# EAGLE design Plant Reminder (EAGLE 9.5.2)
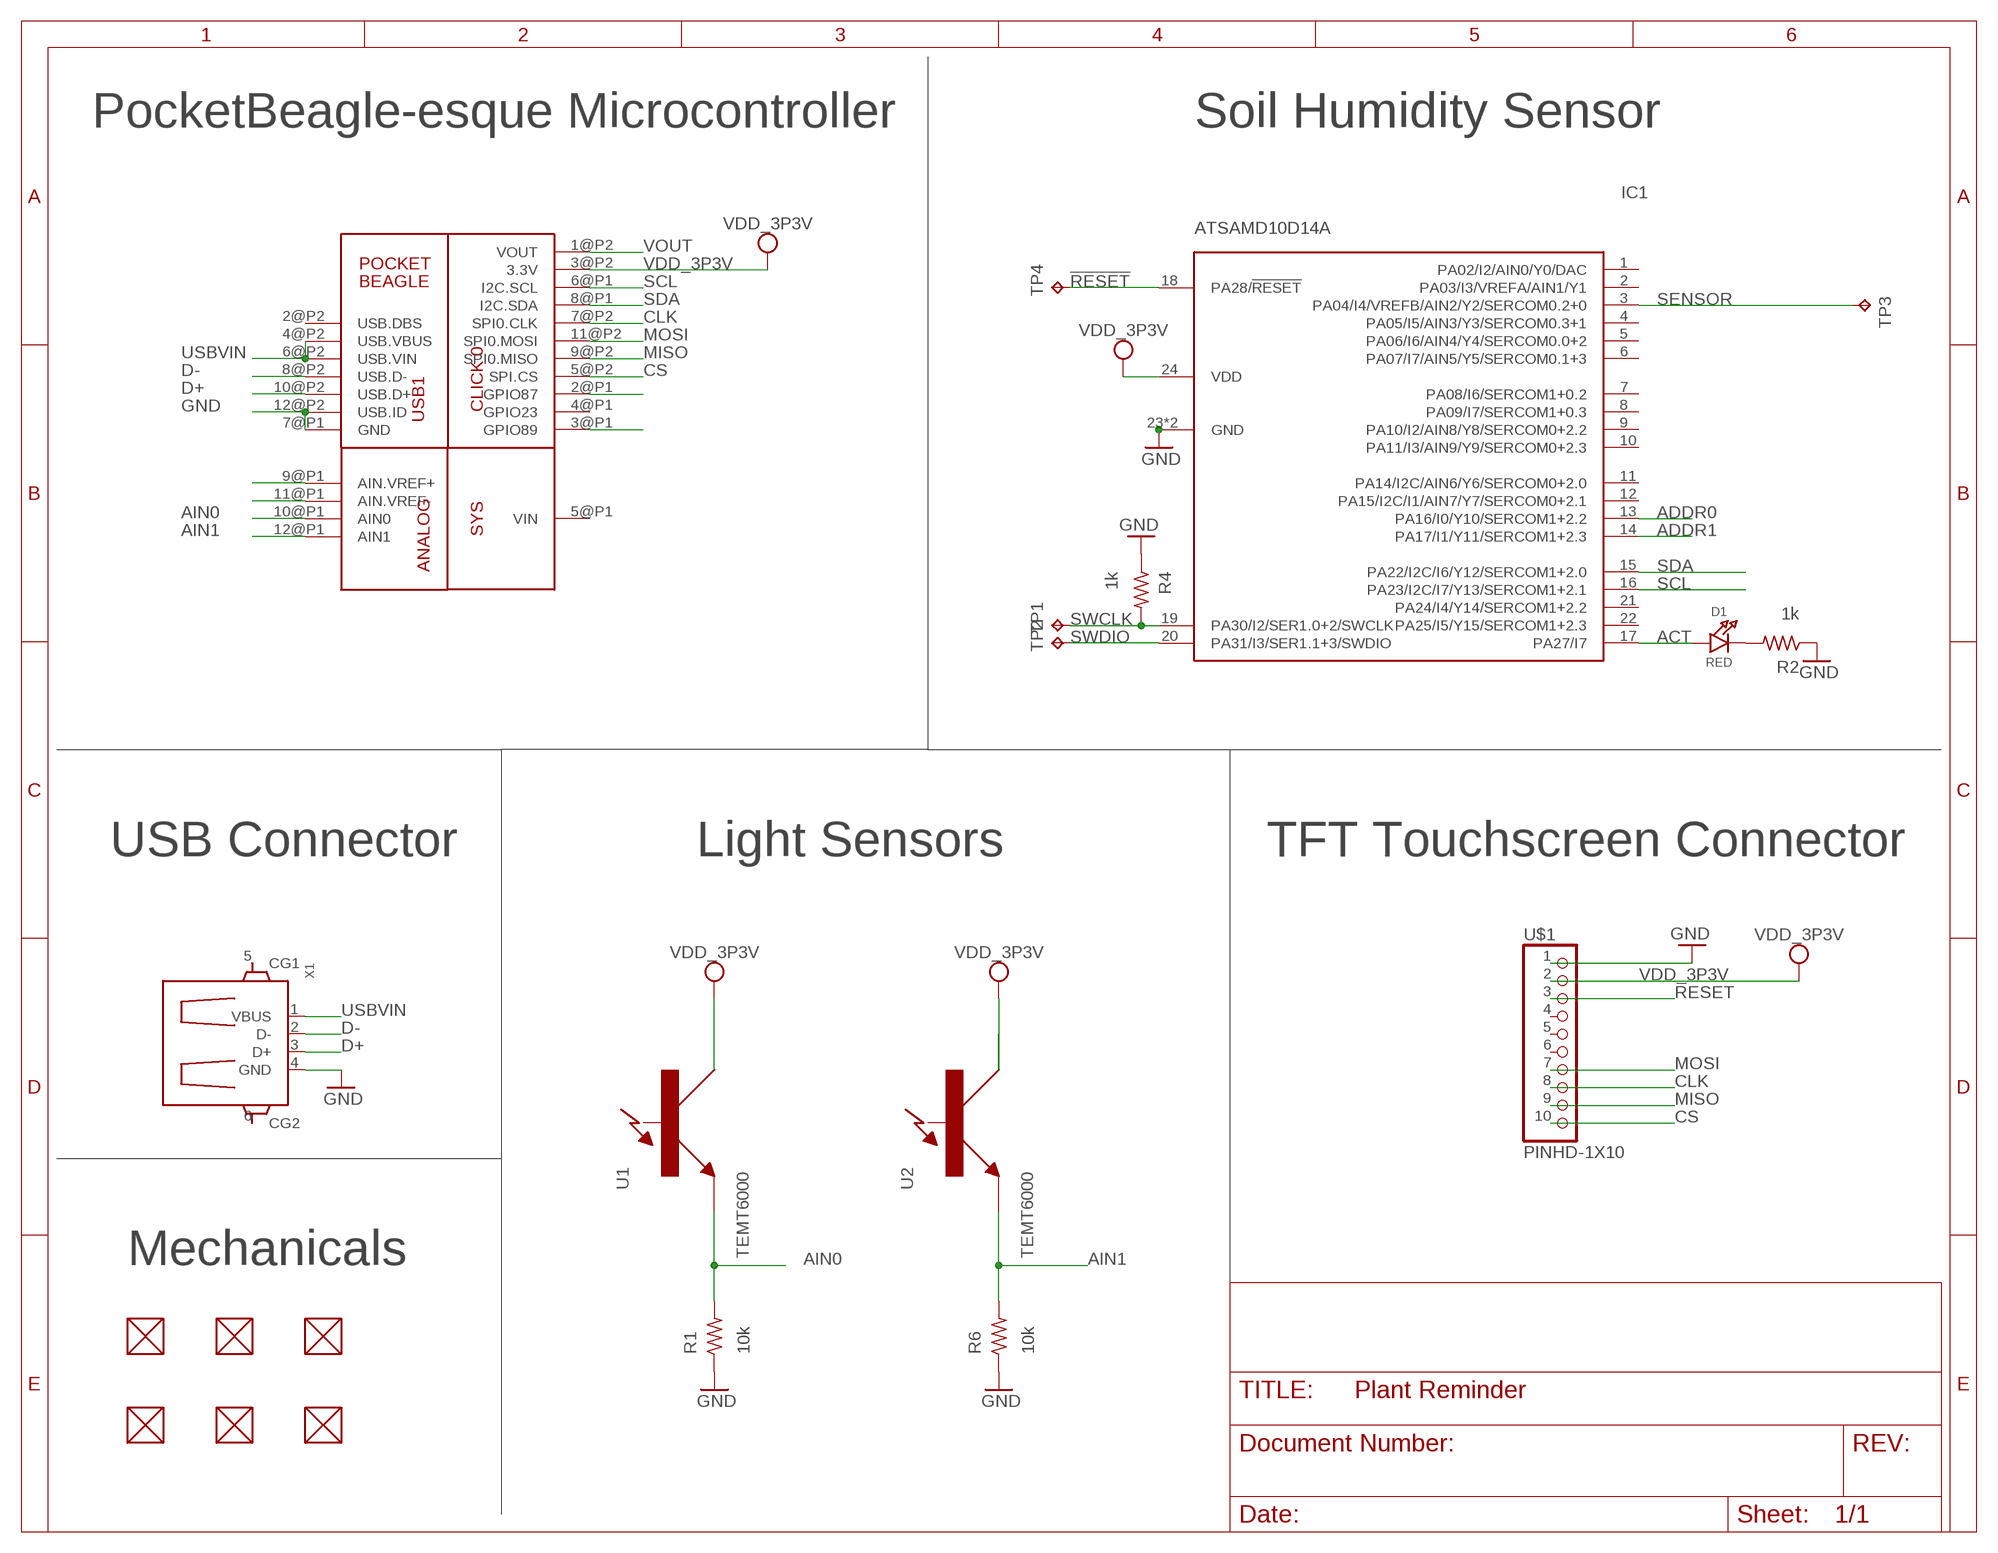
[diagram p0: schematic, sheet 1]

## Parts
D1  RED  LED0805_NOOUTLINE  [CHIPLED_0805_NOOUTLINE]
FUD1  FIDUCIAL  [FIDUCIAL_40MIL]
FUD2  FIDUCIAL  [FIDUCIAL_40MIL]
FUD3  FIDUCIAL  [FIDUCIAL_40MIL]
FUD4  FIDUCIAL  [FIDUCIAL_40MIL]
FUD5  FIDUCIAL  [FIDUCIAL_40MIL]
FUD6  FIDUCIAL  [FIDUCIAL_40MIL]
IC1  ATSAMD10D14A  [QFN24_4MM]
R1  10k  R_R0402  [R0402]
R2  1k  R_R0402  [R0402]
R4  1k  R_R0402  [R0402]
R6  10k  R_R0402  [R0402]
TP1  TPTP15R  [TP15R]
TP2  TPTP15R  [TP15R]
TP3  TPTP10R  [TP10R]
TP4  TPTP15R  [TP15R]
U1  TEMT6000  [TEMT6000]
U2  TEMT6000  [TEMT6000]
U3  POCKETBEAGLE  [POCKETBEAGLE]
U$1  PINHD-1X10  [1X10-BIG]
X1  GHI2_USB_HOST_W/CHASSIS_GND  [GHI2_USB_HOST_HORIZONTAL_W/CHASSIS_GND]

## Nets
!RESET: IC1.18(PA28/!RESET) TP4.TP
ACT: D1.A IC1.17(PA27/I7)
ADDR0: IC1.13(PA16/I0/Y10/SERCOM1+2.2)
ADDR1: IC1.14(PA17/I1/Y11/SERCOM1+2.3)
AIN0: R1.2 U1.P$2 U3.10@P1(AIN0)
AIN1: R6.2 U2.P$2 U3.12@P1(AIN1)
CLK: U3.7@P2(SPI0.CLK) U$1.8
CS: U3.5@P2(SPI.CS) U$1.10
D+: U3.10@P2(USB.D+) X1.3(D+)
D-: U3.8@P2(USB.D-) X1.2(D-)
GND: IC1.23(GND) IC1.THERM(GND) R1.1 R2.1 R4.1 R6.1 U3.7@P1(GND) U3.12@P2(USB.ID) U$1.1 X1.4(GND)
MISO: U3.9@P2(SPI0.MISO) U$1.9
MOSI: U3.11@P2(SPI0.MOSI) U$1.7
N$2: D1.C R2.2
N$3: U3.9@P1(AIN.VREF+)
N$4: U3.3@P1(GPIO89)
N$6: U3.11@P1(AIN.VREF-)
RESET: U3.2@P1(GPIO87) U$1.3
SCL: IC1.16(PA23/I2C/I7/Y13/SERCOM1+2.1) U3.6@P1(I2C.SCL)
SDA: IC1.15(PA22/I2C/I6/Y12/SERCOM1+2.0) U3.8@P1(I2C.SDA)
SENSOR: IC1.3(PA04/I4/VREFB/AIN2/Y2/SERCOM0.2+0) TP3.TP
SWCLK: IC1.19(PA30/I2/SER1.0+2/SWCLK) R4.2 TP1.TP
SWDIO: IC1.20(PA31/I3/SER1.1+3/SWDIO) TP2.TP
USBVIN: U3.4@P2(USB.VBUS) U3.6@P2(USB.VIN) X1.1(VBUS)
VDD_3P3V: IC1.24(VDD) U1.P$1 U2.P$1 U3.3@P2(3.3V) U$1.2
VOUT: U3.1@P2(VOUT)
Unconnected: FUD1.P$1 FUD2.P$1 FUD3.P$1 FUD4.P$1 FUD5.P$1 FUD6.P$1 IC1.1(PA02/I2/AIN0/Y0/DAC) IC1.2(PA03/I3/VREFA/AIN1/Y1) IC1.4(PA05/I5/AIN3/Y3/SERCOM0.3+1) IC1.5(PA06/I6/AIN4/Y4/SERCOM0.0+2) IC1.6(PA07/I7/AIN5/Y5/SERCOM0.1+3) IC1.7(PA08/I6/SERCOM1+0.2) IC1.8(PA09/I7/SERCOM1+0.3) IC1.9(PA10/I2/AIN8/Y8/SERCOM0+2.2) IC1.10(PA11/I3/AIN9/Y9/SERCOM0+2.3) IC1.11(PA14/I2C/AIN6/Y6/SERCOM0+2.0) IC1.12(PA15/I2C/I1/AIN7/Y7/SERCOM0+2.1) IC1.21(PA24/I4/Y14/SERCOM1+2.2) IC1.22(PA25/I5/Y15/SERCOM1+2.3) U1.P$3 U2.P$3 U3.2@P2(USB.DBS) U3.4@P1(GPIO23) U3.5@P1(VIN) U$1.4 U$1.5 U$1.6 X1.5(CG1) X1.6(CG2)

## Notes on the sheet
- PocketBeagle-esque Microcontroller | Soil Humidity Sensor
- TFT Touchscreen Connector
- USB Connector | Light Sensors
- Mechanicals

## Library data of the parts
D1 = microbuilder:LED: LED 0603 - 0603 Surface Mount Package 2mA: Green LED - Low Power (3.9mcd, 2ma, 1.7Vf) - Digikey: 475-2709-2-ND Orange LED - Low Power (9.8mcd, 2ma, 1.8Vf) - Digikey: 475-1194-2-ND Red LED - Low Power (5mcd, 2ma, 1.8Vf) - Digikey: 475-1195-2-ND Yellow LED - Low Power (7mcd, 2ma, 1.8Vf) - Digikey: 475-1196-2-ND 5mA: Blue LED - Low Power (17mcd, 5ma, 2.9Vf) - Digikey: LNJ937W8CRACT-ND 0805 - 0805 Surface Mount Package 2mA: Red LED (8.8mcd, 2mA, 1.8Vf, Clear) - Low Power [Digikey: 475-2510-1-ND] Green LED (5mcd, 2mA, 1.8Vf, Clear) - Low Power [Digikey: 475-2730-1-ND] Yellow LED (11.3mcd, 2mA, 1.8Vf, Clear) - Low Power [Digikey: 475-2555-1-ND] 20mA: Red LED (104mcd, 20mA, Diffused) - LS R976 [Digikey: 475-1278-6-ND] Red LED (12mcd, 20mA, 2.0Vf, Clear) - APT2012EC [Digikey: 754-1128-1-ND] Green LED (15mcd, 20mA, 2.2Vf, Clear) - APT2012GC [Digikey: 754-1131-1-ND] Orange LED (160mcd, 20mA, 2.1Vf, Clear) - APT2012SECK [Digikey: 754-1130-1-ND] 1206 - 1206 Surface Mount Package Green LED (26mcd, 20mA, Diffused) - LG N971 [Digikey: 475-1407-6-ND] Red LED (15mcd, 20mA, Diffused) - LH N974 [Digikey: 475-1416-6-ND] Cree - Cree High-Power Surface Mount LEDs XPEBWT-L1-0000-00D50 - White 111lm 350mA 2.9Vf 6200K 110° XTEAWT-00-0000-00000LEE3 - White 114lm 350mA 2.85Vf 5000K 115° Everlight - Everlight 45-21 Series Surface Mount LEDs 45-21/QK2C-B2832AC2CB2/2T - Warm White 2000mcd 20mA 3.25Vf 3050K 120° 45-21/LK2C-B38452C4CB2/2T - Nuetral White 2000mcd 20mA 3.25Vf 4150K 120° 45-21/LK2C-B50634C6CB2/2T - Cold White 2200mcd 20mA 3.25Vf 5650K 120° PLCC2 Reverse Mount LS T77K-J1L2-1-0-2-R18-Z - Red 11.25mcd 2mA 1.8Vf 630nm 120° LO T77K-L1M2-24-Z - Orange 19.6mcd 2mA 1.8Vf 606nm 120° LY T77K-K2M1-26-Z - Yellow 15.7mcd 2mA 1.8Vf 587nm 120°
FUD1-FUD6 = ENGI301:FIDUCIAL
IC1 = microbuilder:ATSAMD10D14A
R1 R2 R4 R6 = ENGI301:R_: RESISTOR, American symbol
TP1-TP4 = testpad:TP: Test pad
U1 U2 = Plant Reminder:TEMT6000
U3 = Plant Reminder:POCKETBEAGLE
U$1 = Plant Reminder:PINHD-1X10: Pin header 1x10 0.1" spacing With round pins
X1 = Plant Reminder:GHI2_USB_HOST_W/CHASSIS_GND

## Board
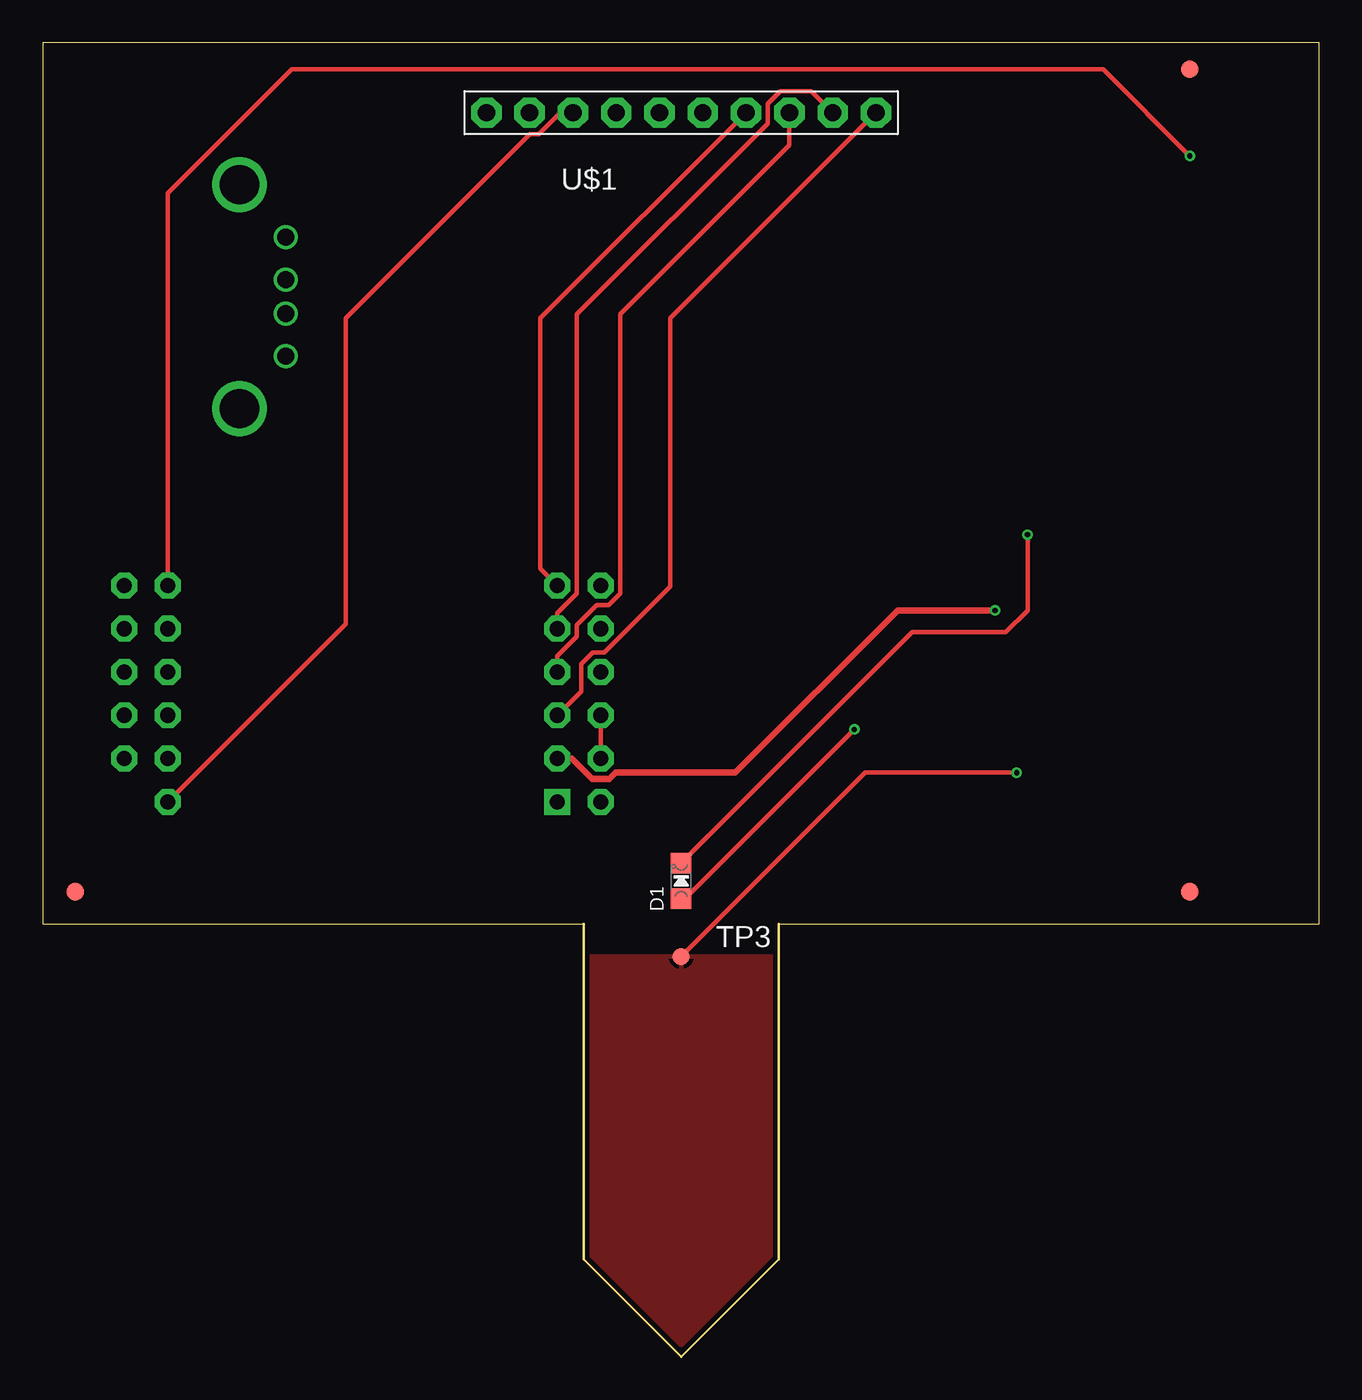
[diagram p1: board, top side]
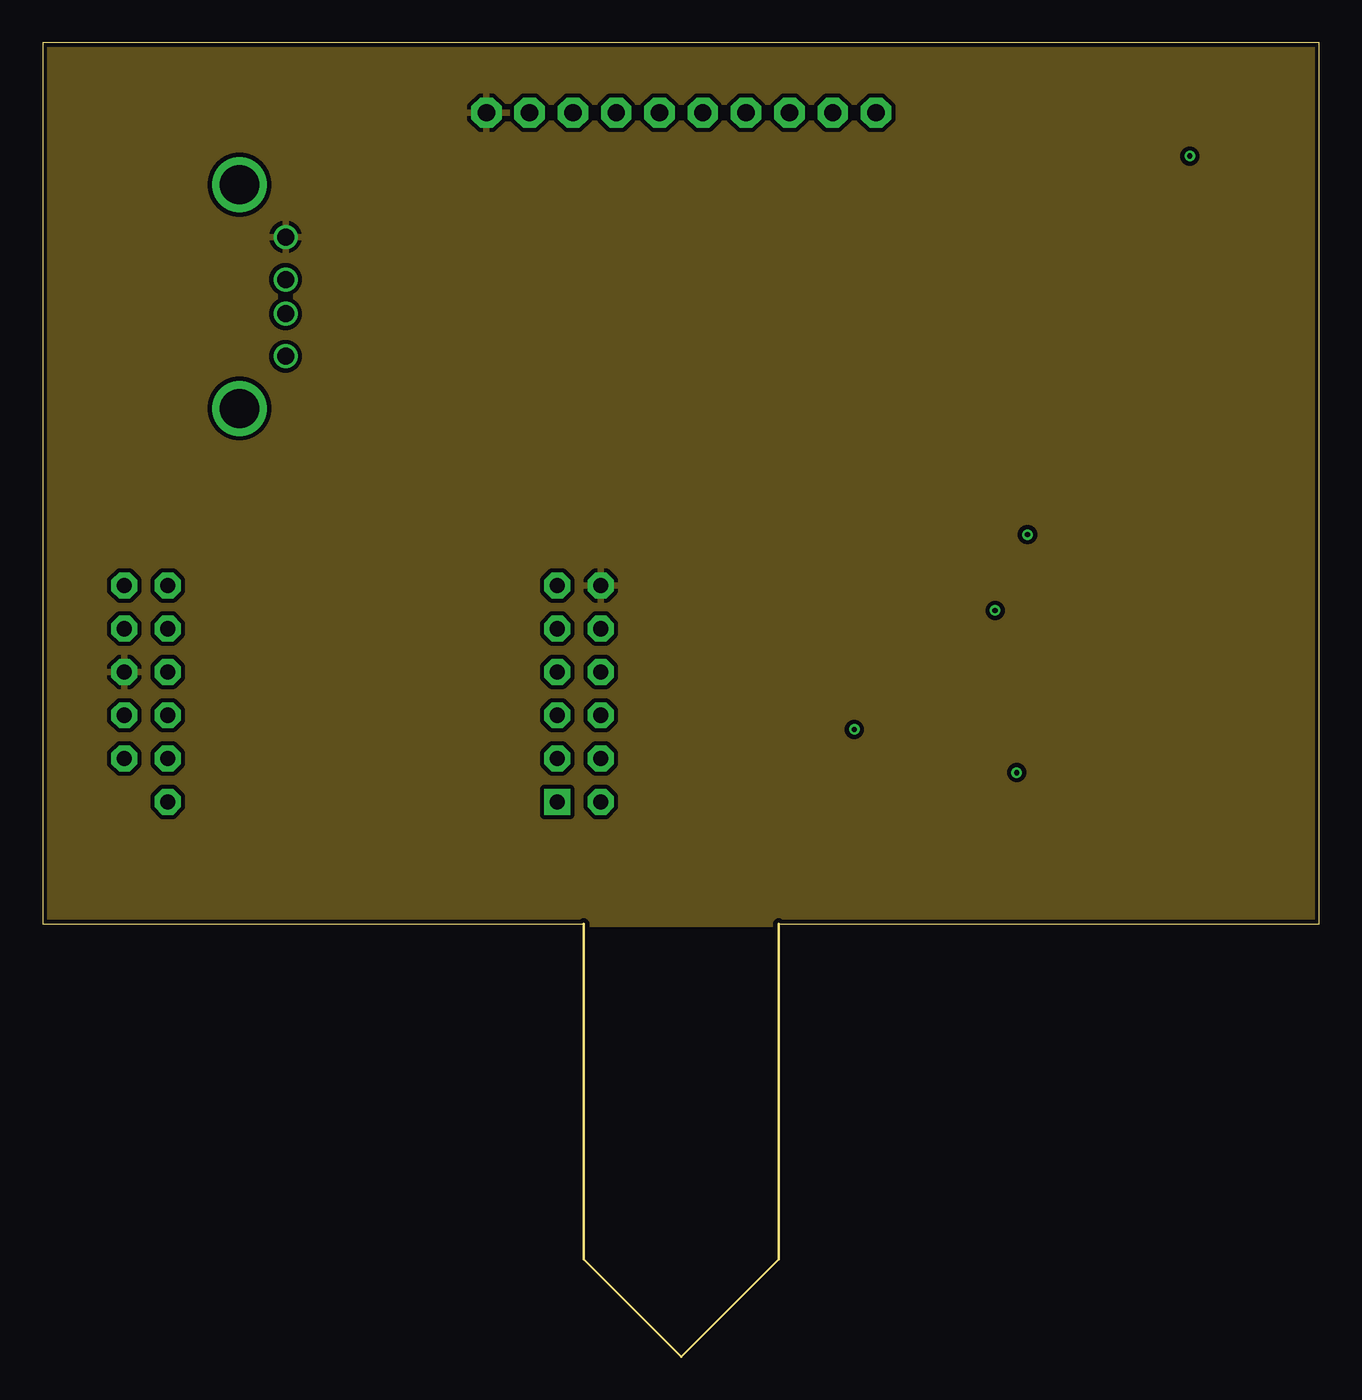
[diagram p2: board, inner layer Route2]
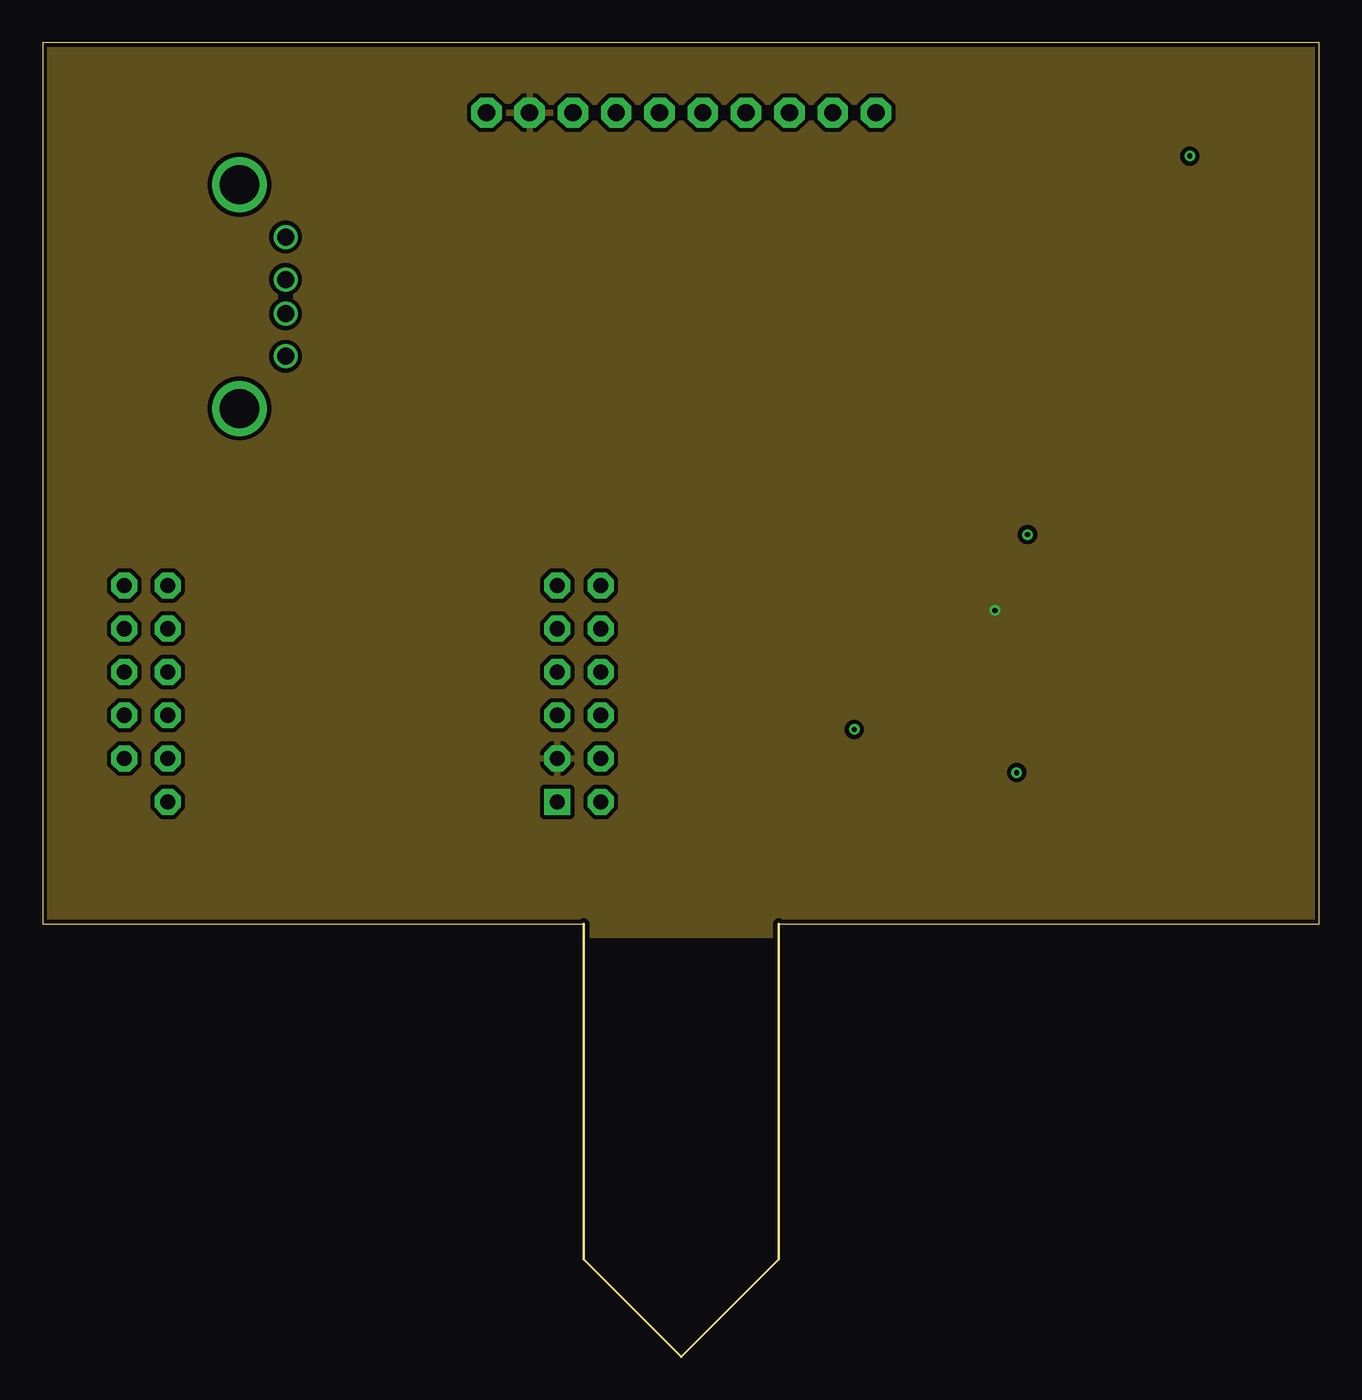
[diagram p3: board, inner layer Route15]
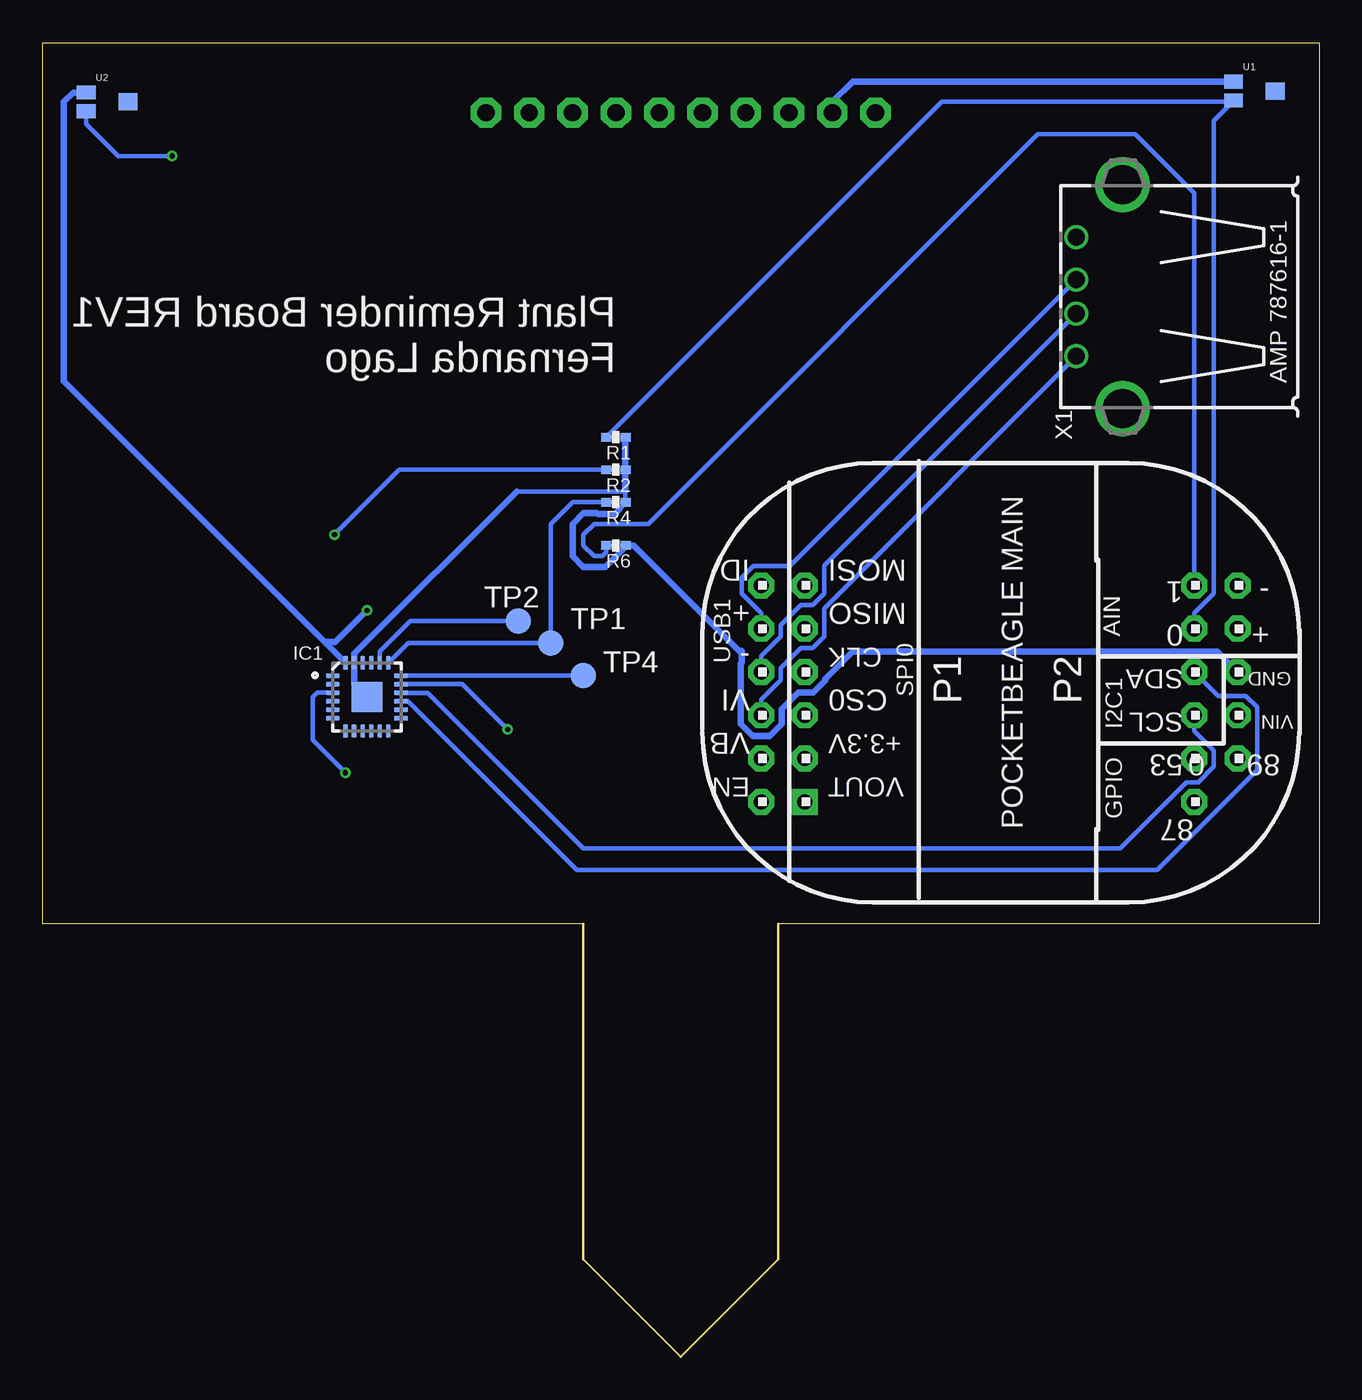
[diagram p4: board, bottom side, seen from below]

Size 74.91 x 77.14 mm. Coordinates in mm from the lower left corner, seen from the top.
Outline: 0,25.4 31.75,25.4 31.75,5.71 37.47,0 43.18,5.71 43.18,25.4 74.91,25.4 74.91,77.14 0,77.14 0,25.4
Copper layers (1*2*15*16): Top 0.035mm / dielectric 0.23mm / Route2 0.035mm / dielectric 0.93mm / Route15 0.035mm / dielectric 0.23mm / Bottom 0.035mm
Design rules "ENGI301_4lyr": minimum track width 10mil, minimum drill 12mil, track to track 10mil, track to pad 10mil, pad to pad 10mil, via to via 10mil, smd to smd 10mil, copper to edge 10mil, drill to drill 12mil, minimum pad ring 6mil, minimum via ring 6mil, stop-mask expansion 3mil, vias tented up to drill 25mil, thermal gap 10mil

### Footprints (pad centres in the part's own frame; a part is rotated, then mirrored left to right if it is on the bottom)
CHIPLED_0805_NOOUTLINE = smd 1.2 x 1.2: A 0,-1.05; C 0,1.05
FIDUCIAL_40MIL = smd 1.016 x 1.016: P$1 0,0
QFN24_4MM = smd 0.8 x 0.28: 1 -2,1.25; 2 -2,0.75; 3 -2,0.25; 4 -2,-0.25; 5 -2,-0.75; 6 -2,-1.25; 13 2,-1.25; 14 2,-0.75; 15 2,-0.25; 16 2,0.25; 17 2,0.75; 18 2,1.25 | smd 0.28 x 0.8: 7 -1.25,-2; 8 -0.75,-2; 9 -0.25,-2; 10 0.25,-2; 11 0.75,-2; 12 1.25,-2; 19 1.25,2; 20 0.75,2; 21 0.25,2; 22 -0.25,2; 23 -0.75,2; 24 -1.25,2 | smd 1.778 x 1.778: THERM 0,0
R0402 = smd 0.61 x 0.508: 1 -0.559,0; 2 0.559,0
TP15R = smd 1.5 x 1.5: TP 0,0
TP10R = smd 1 x 1: TP 0,0
TEMT6000 = smd 1.1 x 0.8: P$1 -1.225,0.55; P$2 -1.225,-0.55 | smd 1.1 x 1: P$3 1.225,0
POCKETBEAGLE = drill 0.889 pad 1.524 square: 1@P2 5.91,29.565 | drill 0.889 pad 1.524 octagon: 2@P1 5.91,6.705; 2@P2 5.91,32.105; 3@P1 8.45,4.165; 3@P2 8.45,29.565; 4@P1 8.45,6.705; 4@P2 8.45,32.105; 5@P1 10.99,4.165; 5@P2 10.99,29.565; 6@P1 10.99,6.705; 6@P2 10.99,32.105; 7@P1 13.53,4.165; 7@P2 13.53,29.565; 8@P1 13.53,6.705; 8@P2 13.53,32.105; 9@P1 16.07,4.165; 9@P2 16.07,29.565; 10@P1 16.07,6.705; 10@P2 16.07,32.105; 11@P1 18.61,4.165; 11@P2 18.61,29.565; 12@P1 18.61,6.705; 12@P2 18.61,32.105
1X10-BIG = drill 1.016 pad 1.778 octagon: 1 -11.43,0; 2 -8.89,0; 3 -6.35,0; 4 -3.81,0; 5 -1.27,0; 6 1.27,0; 7 3.81,0; 8 6.35,0; 9 8.89,0; 10 11.43,0
GHI2_USB_HOST_HORIZONTAL_W/CHASSIS_GND = drill 1: 1 -3.5,12.99; 2 -1,12.99; 3 1,12.99; 4 3.5,12.99 | drill 2.3: 5 -6.57,10.28; 6 6.57,10.28

### Placement (x,y rotation side)
D1  37.47,27.94 0 top
FUD1  1.91,27.3 0 top
FUD2  67.31,27.3 0 top
FUD3  67.31,75.56 0 top
FUD4  1.91,27.3 0 top
FUD5  67.31,27.3 0 top
FUD6  67.31,75.56 0 top
IC1  55.88,38.73 0 bottom
R1  41.27,53.97 180 bottom
R2  41.27,52.07 180 bottom
R4  41.27,50.16 180 bottom
R6  41.27,47.62 180 bottom
TP1  45.09,41.91 0 bottom
TP2  46.99,43.18 0 bottom
TP3  37.47,23.49 0 top
TP4  43.18,40 0 bottom
U1  3.81,74.3 0 bottom
U2  71.12,73.66 0 bottom
U3  0.64,26.67 90 bottom
U$1  37.47,73.03 0 top
X1  1.27,62.23 90 bottom

### Tracks (layer width: path | path; a pad name or v marks a point on that pad's centre or on a via)
!RESET
  Bottom 0.254: TP4.TP 53.86,40 IC1.18
ACT  (via drill 0.3)
  Top 0.254: v47.62,36.83 37.69,26.89 D1.A
  Bottom 0.254: v47.62,36.83 50.28,39.48 IC1.17
AIN0
  Bottom 0.254: U1.P$2 5.04,73.66 5.08,73.66 | R1.2 22.15,73.66 5.08,73.66 | U3.10@P1 7.34,43.66 6.2,44.81 6.2,72.54 5.08,73.66
AIN1  (via drill 0.3)
  Top 0.254: U3.12@P1 7.34,68.3 14.61,75.56 62.23,75.56 v67.31,70.48
  Bottom 0.254: U3.12@P1 7.34,68.3 10.79,71.75 16.51,71.75 39.37,48.89 42.55,48.89 43.18,48.26 43.18,47.62 42.55,46.99 42.08,46.99 41.83,47.24 R6.2 | v67.31,70.48 70.48,70.48 72.34,72.34 U2.P$2
CLK
  Top 0.254: U3.7@P2 30.2,41.12 31.34,42.27 31.34,42.96 32.52,44.14 33.21,44.14 33.88,44.81 33.88,61.19 43.81,71.12 U$1.8
CS
  Top 0.254: U3.5@P2 31.6,39.06 31.6,40.67 32.27,41.34 32.96,41.34 36.83,45.21 36.83,60.96 U$1.10
D+
  Bottom 0.254: U3.10@P2 32.74,43.66 33.88,44.81 33.88,45.75 33.21,46.42 31.07,46.42 X1.3
D-
  Bottom 0.254: X1.2 29.06,46.43 29.06,44.81 29.73,44.14 30.42,44.14 31.6,42.96 31.6,42.27 32.74,41.12 U3.8@P2
GND
  Bottom 0.254: R4.1 40.72,50.8 47.1,50.8 | R6.1 40.68,47.59
  Bottom 0.381: R1.1 R2.1 40.72,50.8 | 47.1,50.8 56.63,41.27 IC1.23 56.63,39.48 IC1.THERM | 40.68,47.59 41.91,46.35 43.18,46.35 43.81,46.99 43.81,48.89 43.18,49.53 42.39,49.53 42.32,49.47 41.34,49.47 41.08,49.73 41.08,49.8 R4.1 | 33.88,41.43 33.88,41.27 | 33.88,41.27 33.88,40.76 33.95,40.7 33.95,37.16 33.24,36.45 32.24,36.45 31.53,37.16 31.53,38.03 30.57,38.99 29.7,38.99 28.99,39.7 28.99,39.79 27.38,41.41 6.01,41.41 U3.7@P1 | 33.88,41.27 40.23,47.62 R6.1
  pour Route2: -1.91,79.38 -1.91,25.4 77.47,25.4 77.47,79.38
MISO
  Top 0.254: U3.9@P2 30.2,43.66 31.34,44.81 31.34,61.19 42.55,72.39 42.55,73.55 43.29,74.3 45.09,74.3 U$1.9
MOSI
  Top 0.254: U3.11@P2 29.21,46.27 29.21,60.96 U$1.7
N$2  (via drill 0.3)
  Top 0.254: D1.C 51.02,42.55 56.52,42.55 57.78,43.81 v57.78,48.26
  Bottom 0.254: R2.2 53.98,52.07 v57.78,48.26
RESET
  Top 0.254: U3.2@P1 17.78,43.02 17.78,60.96 28.57,71.75 29.1,71.75 30.37,73.03 U$1.3
SCL
  Bottom 0.254: U3.6@P1 7.34,36.74 6.2,35.59 6.2,34.65 7.12,33.72 7.81,33.72 11.69,29.84 43.18,29.84 52.31,38.98 53.87,38.98 IC1.16
SDA
  Bottom 0.254: IC1.15 53.48,38.48 49.41,34.41 49.29,34.29 43.57,28.57 9.53,28.57 3.66,34.44 3.66,38.13 4.33,38.8 5.94,38.8 U3.8@P1
SENSOR  (via drill 0.3)
  Top 0.254: TP3.TP 48.26,34.29 v57.15,34.29
  Bottom 0.254: v57.15,34.29 59.05,36.2 59.05,38.73 58.8,38.98 IC1.3
  pour Top: 31.11,23.49 43.81,23.49 43.81,5.71 37.47,-0.64 31.11,5.71
SWCLK
  Bottom 0.254: IC1.19 53.45,41.91 TP1.TP 45.09,48.89 43.81,50.16 R4.2
SWDIO
  Bottom 0.254: TP2.TP 53.34,43.18 55.13,41.39 IC1.20
USBVIN
  Top 0.254: U3.4@P2 U3.6@P2
  Bottom 0.254: X1.1 29.06,43.93 29.06,42.27 29.73,41.6 30.42,41.6 31.6,40.42 31.6,39.73 32.74,38.58 U3.6@P2
VDD_3P3V  (via drill 0.3)
  Top 0.381: U3.3@P2 31.03,35.12 32.24,33.91 33.24,33.91 33.62,34.29 40.64,34.29 50.16,43.81 v55.88,43.81
  Bottom 0.254: 57.15,40.73 IC1.24
  Bottom 0.381: U1.P$1 27.39,74.84 28.57,73.66 U$1.2 | IC1.24 58.36,41.97 | 58.36,41.97 73.66,57.27 73.66,73.66 73.11,74.21 U2.P$1 | 58.36,41.97 57.73,41.97 v55.88,43.81
  pour Route15: -4.45,81.28 80.64,81.28 80.64,24.76 -4.45,24.76

### Text on the board
bNames: Plant Reminder Board REV1 / Fernanda Lago